# Altium schematic sheet VGAController.SCHDOC: LiveDesign Evaluation - Video Games
size A; Organization: Altium Limited; Address1: L3, 12a Rodborough Rd; Address2: Frenchs Forest; Address3: NSW; Address4: Australia 2086; DocumentNumber: 9; SheetNumber: 9; SheetTotal: 13
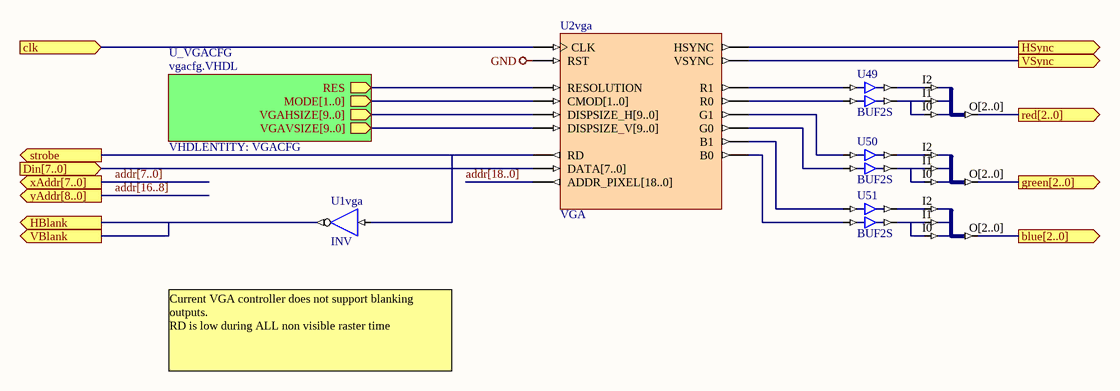
[diagram p0: VGAController.SCHDOC]

## Parts
U1vga  INV
U2vga  VGA
U49  BUF2S
U50  BUF2S
U51  BUF2S
U52  J3S_3B  (value not drawn)
U53  J3S_3B  (value not drawn)
U54  J3S_3B  (value not drawn)

## Sub-sheets
U_VGACFG = vgacfg.VHDL: MODE[1..0] (out), RES (out), VGAHSIZE[9..0] (out), VGAVSIZE[9..0] (out)  | VHDLENTITY: VGACFG

## Ports
blue[2..0] (out), clk (in), Din[7..0] (in), green[2..0] (out), HBlank (out), HSync (out), red[2..0] (out), strobe (out), VBlank (out), VSync (out), xAddr[7..0] (out), yAddr[8..0] (out)

## Nets
GND: U2vga.RST
addr[18..0]: U2vga.ADDR_PIXEL[18..0]
blue[2..0]: U54.O[2..0] ; port blue[2..0]
clk: U2vga.CLK ; port clk
Din[7..0]: U2vga.DATA[7..0] ; port Din[7..0]
green[2..0]: U53.O[2..0] ; port green[2..0]
HBlank: U1vga.O ; port VBlank, port HBlank
HSync: U2vga.HSYNC ; port HSync
red[2..0]: U52.O[2..0] ; port red[2..0]
strobe: U1vga.I U2vga.RD ; port strobe
VSync: U2vga.VSYNC ; port VSync
NetU2vga_B0: U2vga.B0 U51.I1
NetU2vga_B1: U2vga.B1 U51.I0
NetU2vga_CMOD[1..0]: U2vga.CMOD[1..0] ; sheet U_VGACFG/MODE[1..0]
NetU2vga_DISPSIZE_H[9..0]: U2vga.DISPSIZE_H[9..0] ; sheet U_VGACFG/VGAHSIZE[9..0]
NetU2vga_DISPSIZE_V[9..0]: U2vga.DISPSIZE_V[9..0] ; sheet U_VGACFG/VGAVSIZE[9..0]
NetU2vga_G0: U2vga.G0 U50.I1
NetU2vga_G1: U2vga.G1 U50.I0
NetU2vga_R0: U2vga.R0 U49.I1
NetU2vga_R1: U2vga.R1 U49.I0
NetU2vga_RESOLUTION: U2vga.RESOLUTION ; sheet U_VGACFG/RES
NetU49_O0: U49.O0 U52.I2
NetU49_O1: U49.O1 U52.I0 U52.I1
NetU50_O0: U50.O0 U53.I2
NetU50_O1: U50.O1 U53.I0 U53.I1
NetU51_O0: U51.O0 U54.I2
NetU51_O1: U51.O1 U54.I0 U54.I1

## Buses and harness runs
bus addr[7..0] = port xAddr[7..0]
bus addr[16..8] = port yAddr[8..0]
bus addr[18..0]

## Notes on the sheet
- Current VGA controller does not support blanking outputs.
  RD is low during ALL non visible raster time
- Title
- Size:
- Date:
- A
- Number:
- Time:
- Revision:
- Sheet
- of
- File:

## Library data of the parts
U1vga = INV: Inverter; ArchiveName: GENERIC; Published: 9-30-2003; Publisher: Altium Limited; Xilinx Equivalent: INV; Core Revision: 1.00.00
U2vga = VGA: VGA Controller; Published: 21/10/2003; Publisher: Altium Hobart Technology Centre; Core Revision: 1.00.00
U49-U51 = BUF2S: 2-Bit General Purpose (Non-inverting) Buffer, Single Pin Version; ArchiveName: GENERIC; VHDLIB_SIM: GENERIC_LIB; Published: 29-Jan-2004; Publisher: Altium Limited; Core Revision: 1.00.00
U52-U54 = J3S_3B: 3 Single pin inputs to single 3-Bit output bus; ArchiveName: GENERIC; VHDLIB_SIM: GENERIC_LIB; Published: 29-Jan-2004; Publisher: Altium Limited; Core Revision: 1.00.00